# Altium schematic sheet Power.SchDoc
size A4
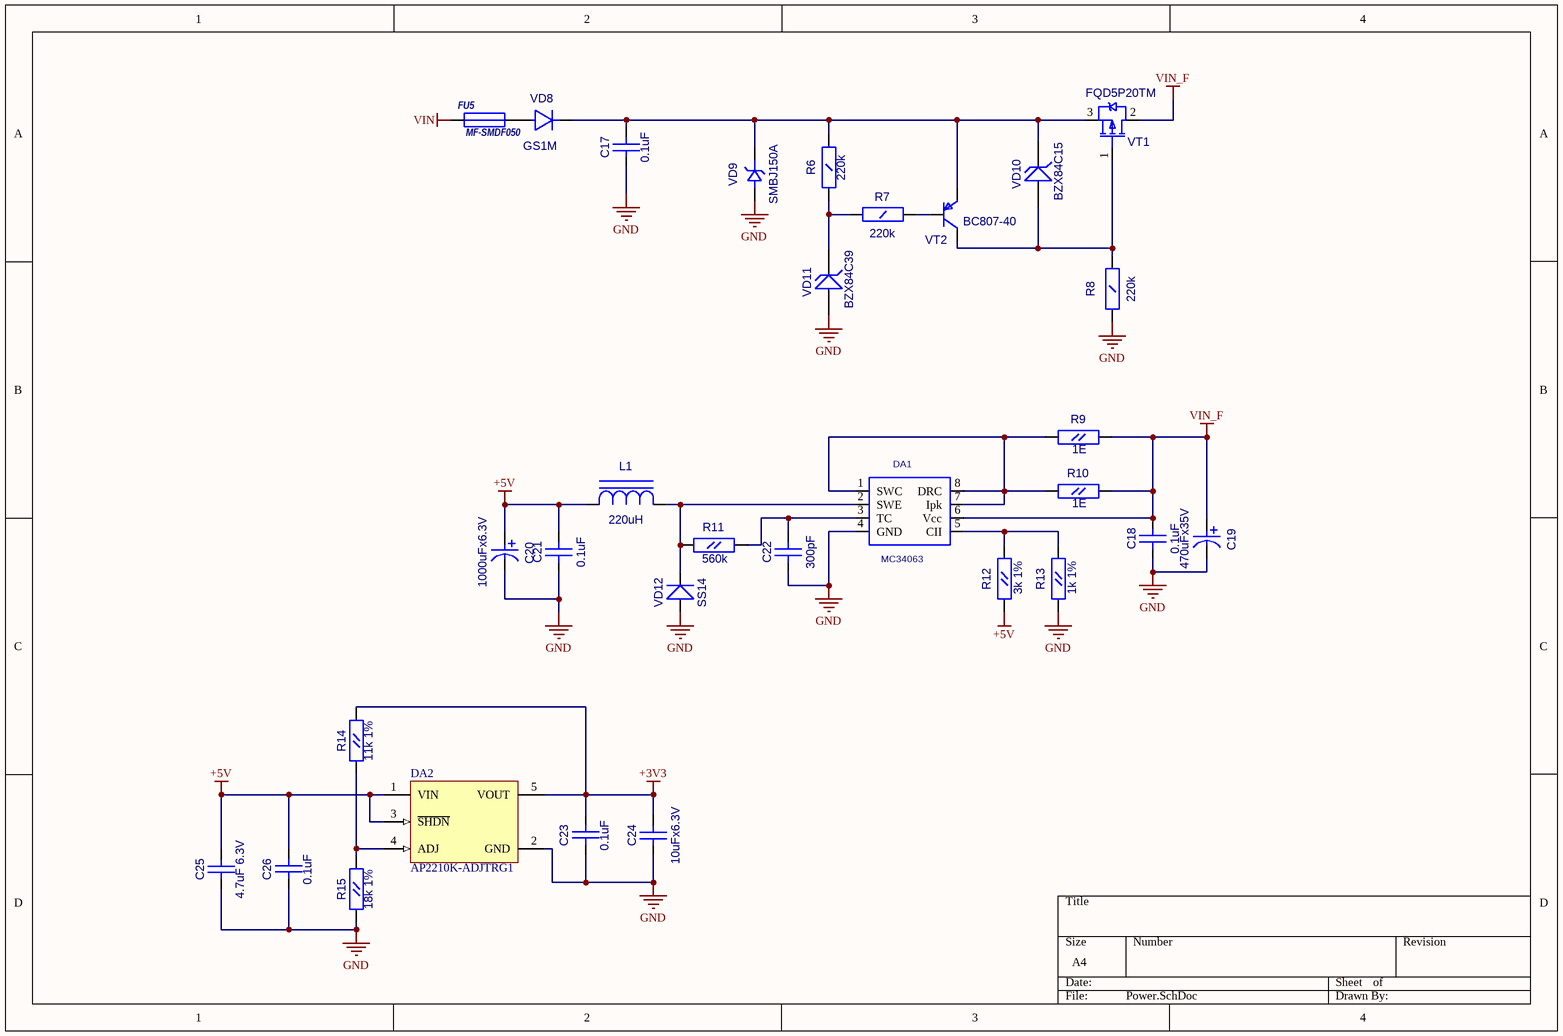
[diagram p0: Power.SchDoc]

## Parts
C17  0.1uF  [CC1206]
C18  0.1uF  [CC0603]
C19  470uFx35V  [CC16X10_CAP0.5(1)(Primary)]
C20  1000uFx6.3V  [CC8X3.5]
C21  0.1uF  [CC0603]
C22  300pF  [CC0603]
C23  0.1uF  [CC0603]
C24  10uFx6.3V  [CC0805]
C25  4.7uF 6.3V  [CC0805]
C26  0.1uF  [CC0603]
DA1  MC34063  [SO-8]
DA2  AP2210K-ADJTRG1  [SOT23-5]
FU5  MF-SMDF050  [MF-SMDF]
L1  220uH  [SDR0805]
R6  220k  [RC1206]
R7  220k  [RC1206]
R8  220k  [RC1206]
R9  1E  [RC0805]
R10  1E  [RC0805]
R11  560k  [RC0603]
R12  3k 1%  [RC0603]
R13  1k 1%  [RC0603]
R14  11k 1%  [RC0603]
R15  18k 1%  [RC0603]
VD8  GS1M  [SMA]
VD9  SMBJ150A  [SMB]
VD10  BZX84C15  [SOT-23(123)]
VD11  BZX84C39  [SOT-23(123)]
VD12  SS14  [SMA]
VT1  FQD5P20TM  [D-PAK(TO-252AA)]
VT2  BC807-40  [SOT-23(123)]

## Nets
+3V3: C23.1(A) C24.2(B) DA2.5(VOUT) R14.2(B)
+5V: C20.1 C21.2(B) C25.2(B) C26.1(A) DA2.1(VIN) DA2.3(~{SHDN}) L1.1(C) R12.1(A)
GND: C17.1(A) C18.1(A) C19.1 C20.2 C21.1(A) C22.1(A) C23.2(B) C24.1(A) C25.1(A) C26.2(B) DA1.4(GND) DA2.2(GND) R8.2(B) R13.1(A) R15.1(A) VD9.1(A) VD11.1(A) VD12.1(A)
VIN: FU5.1
VIN_F: C18.2(B) C19.2 DA1.6(Vcc) R9.2(B) R10.2(B) VT1.2(D)
NetC17_2: C17.2(B) R6.2(B) VD8.2(K) VD9.2(K) VD10.3(K) VT1.3(S) VT2.2(E)
NetC22_2: C22.2(B) DA1.3(TC) R11.2(B)
NetDA1_1: DA1.1(SWC) DA1.7(Ipk) DA1.8(DRC) R9.1(A) R10.1(A)
NetDA1_2: DA1.2(SWE) L1.2(A) R11.1(A) VD12.2(K)
NetDA1_5: DA1.5(CII) R12.2(B) R13.2(B)
NetDA2_4: DA2.4(ADJ) R14.1(A) R15.2(B)
NetFU5_2: FU5.2 VD8.1(A)
NetR6_1: R6.1(A) R7.1(A) VD11.3(K)
NetR7_2: R7.2(B) VT2.1(B)
NetR8_1: R8.1(A) VD10.1(A) VT1.1(G) VT2.3(C)

## Library data of the parts
C17 = CC1206: Value: 0.1uF
C18 C21-C23 C26 = CC0603
  C18 C21 C23 C26: Value: 0.1uF
  C22: Value: 300pF
C19 = CAP0.5(1): Value: 470uFx35V
C20 = CAP0.35: Value: 1000uFx6.3V
C24 C25 = CC0805
  C24: Value: 10uFx6.3V
  C25: Value: 4.7uF 6.3V
DA2 = MCP1824T-ADJE/OT: 300 mA, Low Voltage, Low Quiescent Current LDO Regulator, 5-Pin SOT-223, Extended Temperature, Tape and Reel; Published: 29-Jan-2009; DatasheetVersion: revA, Aug-2007; PackageVersion: revAW, Oct-2008; PackageReference: SOT-223-DC5; Publisher: Altium Limited; PackageDescription: 5-Lead Plastic Small Outline Transistor (DC) [SOT-223]; ComponentLink1Description: Manufacturer Link; ComponentLink1URL: http://www.microchip.com; ComponentLink2Description: Datasheet; ComponentLink2URL: http://ww1.microchip.com/downloads/en/DeviceDoc/22070a.pdf; ComponentLink3Description: Packaging Specification; ComponentLink3URL: http://ww1.microchip.com/downloads/en/PackagingSpec/00049AW.pdf
FU5 = MF-SMDF: Value: MF-SMDF050
L1 = SDR0805: Value: 220uH
R6-R8 = RC1206: Value: 220k
R9 R10 = RC0805: Value: 1E
R11-R15 = RC0603
  R11: Value: 560k
  R12: Value: 3k 1%
  R13: Value: 1k 1%
  R14: Value: 11k 1%
  R15: Value: 18k 1%
VD8 = GS1M: Value: {Value}
VD9 = SMBJ: Value: SMBJ150A
VD10 VD11 = BZX84: Zener Voltage Regulator Diode; Value: {Value}
VD12 = SS14: Schottky Rectifier; OriginalName: 10BQ100; ComponentField6: Published 8-Jun-2000, Modified 10-July-2000: SIM Model Added.; Value: SS14
VT1 = IRFR9220: HEXFET Power MOSFET; OriginalName: IRLML5103; ComponentField7: Published 8-Jun-2000; Value: FQD5P20TM
VT2 = BC857B: OriginalName: BC846BLT1; ComponentField7: Published 29-Sep-2000; Value: BC807-40
DA1 = MC34063: Value: *